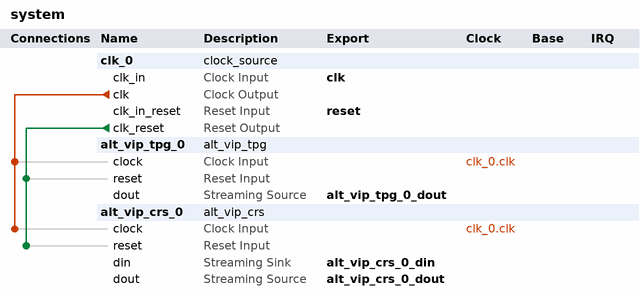
[diagram p0: system contents]
# Platform Designer (Qsys) system system, Cyclone II EP2C20F484C7
# Parameters at their usual value, and those the tool derives, are not listed.
package require -exact qsys 13.0
create_system system
set_project_property DEVICE_FAMILY {Cyclone II}
set_project_property DEVICE EP2C20F484C7

add_instance clk_0 clock_source 13.0
set_instance_parameter_value clk_0 clockFrequency 50000000

add_instance alt_vip_tpg_0 alt_vip_tpg 13.0
set_instance_parameter_value alt_vip_tpg_0 CHANNELS_IN_PAR 1
set_instance_parameter_value alt_vip_tpg_0 CTRL_INTERFACE_DEPTH 10
set_instance_parameter_value alt_vip_tpg_0 PARAMETERISATION {<testPatternGeneratorParams><TPG_NAME>MyPatternGenerator</TPG_NAME><TPG_RUNTIME_CONTROL>0</TPG_RUNTIME_CONTROL><TPG_BPS>8</TPG_BPS><TPG_MAX_WIDTH>1920</TPG_MAX_WIDTH><TPG_MAX_HEIGHT>1080</TPG_MAX_HEIGHT><TPG_COLORSPACE>COLORSPACE_YCbCr</TPG_COLORSPACE><TPG_FORMAT>SAMPLE_444</TPG_FORMAT><TPG_INTERLACE>PROGRESSIVE_FRAMES</TPG_INTERLACE><TPG_PARALLEL_MODE>false</TPG_PARALLEL_MODE><TPG_PATTERN>TPG_PATTERN_COLORBARS</TPG_PATTERN><TPG_UNIFORM_VAL_C1>128</TPG_UNIFORM_VAL_C1><TPG_UNIFORM_VAL_C2>128</TPG_UNIFORM_VAL_C2><TPG_UNIFORM_VAL_C3>128</TPG_UNIFORM_VAL_C3></testPatternGeneratorParams>}

add_instance alt_vip_crs_0 alt_vip_crs 13.0
set_instance_parameter_value alt_vip_crs_0 OUT_CHANNELS_IN_PAR 1
set_instance_parameter_value alt_vip_crs_0 IN_CHANNELS_IN_PAR 1
set_instance_parameter_value alt_vip_crs_0 PARAMETERISATION {<chromaResamplerParams><CRS_NAME>chroma_resampler</CRS_NAME><CRS_BPS>8</CRS_BPS><CRS_WIDTH>1920</CRS_WIDTH><CRS_HEIGHT>1080</CRS_HEIGHT><CRS_PARALLEL_MODE>false</CRS_PARALLEL_MODE><CRS_RESAMPLING><FORMAT><IN>444</IN><OUT>444</OUT></FORMAT><COSITING><V>true</V><H>true</H></COSITING></CRS_RESAMPLING><CRS_ALGORITHM><V><NAME>INTERPOLATION_1D_NEAREST_NEIGHBOUR</NAME><LUMA_ADAPTIVE>false</LUMA_ADAPTIVE></V><H><NAME>INTERPOLATION_1D_NEAREST_NEIGHBOUR</NAME><LUMA_ADAPTIVE>true</LUMA_ADAPTIVE></H></CRS_ALGORITHM></chromaResamplerParams>}

# connections
add_connection clk_0.clk alt_vip_crs_0.clock clock
add_connection clk_0.clk alt_vip_tpg_0.clock clock
add_connection clk_0.clk_reset alt_vip_crs_0.reset reset
add_connection clk_0.clk_reset alt_vip_tpg_0.reset reset

# exported interfaces
add_interface clk clock sink
set_interface_property clk EXPORT_OF clk_0.clk_in
add_interface reset reset sink
set_interface_property reset EXPORT_OF clk_0.clk_in_reset
add_interface alt_vip_crs_0_dout avalon_streaming source
set_interface_property alt_vip_crs_0_dout EXPORT_OF alt_vip_crs_0.dout
add_interface alt_vip_tpg_0_dout avalon_streaming source
set_interface_property alt_vip_tpg_0_dout EXPORT_OF alt_vip_tpg_0.dout
add_interface alt_vip_crs_0_din avalon_streaming sink
set_interface_property alt_vip_crs_0_din EXPORT_OF alt_vip_crs_0.din

set_interconnect_requirement {$system} qsys_mm.clockCrossingAdapter HANDSHAKE
set_interconnect_requirement {$system} qsys_mm.maxAdditionalLatency 1

save_system system.qsys
